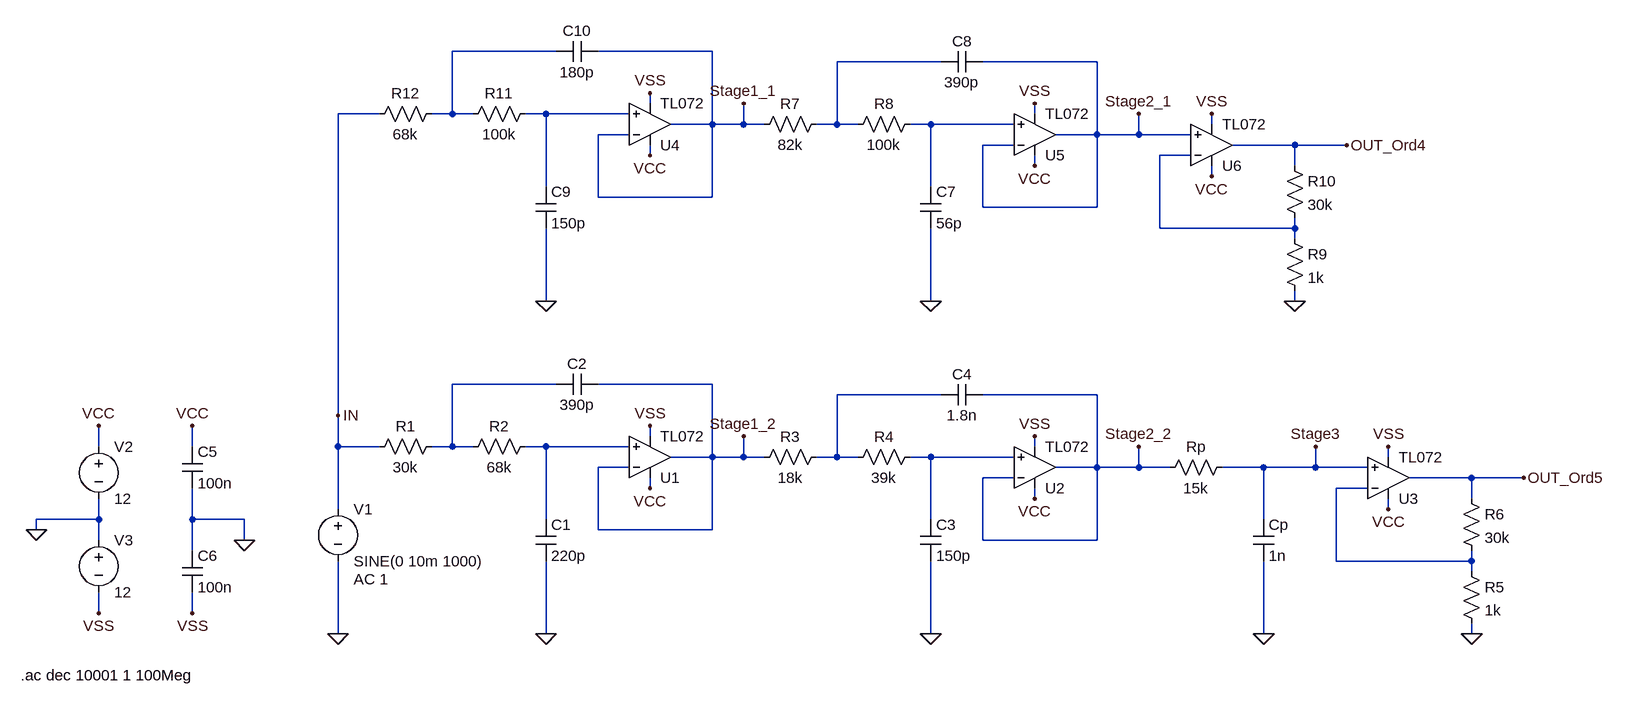
[diagram p0: schematic SK_ordnung4vgl5_10kHz_1dB_30dB_butter_3OPV.asc]
SK_ordnung4vgl5_10kHz_1dB_30dB_butter_3OPV.asc, the LTspice schematic file:
Version 4
SHEET 1 1468 736
WIRE -160 -416 -320 -416
WIRE 80 -416 -96 -416
WIRE 432 -400 272 -400
WIRE 672 -400 496 -400
WIRE -16 -336 -16 -352
WIRE -432 -320 -496 -320
WIRE -320 -320 -320 -416
WIRE -320 -320 -352 -320
WIRE -288 -320 -320 -320
WIRE -176 -320 -208 -320
WIRE -48 -320 -176 -320
WIRE 576 -320 576 -336
WIRE 80 -304 80 -416
WIRE 80 -304 16 -304
WIRE 128 -304 128 -336
WIRE 128 -304 80 -304
WIRE 160 -304 128 -304
WIRE 272 -304 272 -400
WIRE 272 -304 240 -304
WIRE 304 -304 272 -304
WIRE 416 -304 384 -304
WIRE 544 -304 416 -304
WIRE 848 -304 848 -320
WIRE -48 -288 -96 -288
WIRE 672 -288 672 -400
WIRE 672 -288 608 -288
WIRE 736 -288 736 -320
WIRE 736 -288 672 -288
WIRE 816 -288 736 -288
WIRE 544 -272 496 -272
WIRE 976 -272 880 -272
WIRE 1056 -272 976 -272
WIRE -16 -256 -16 -272
WIRE 816 -256 768 -256
WIRE 576 -240 576 -256
WIRE 976 -240 976 -272
WIRE 848 -224 848 -240
WIRE -176 -208 -176 -320
WIRE 416 -208 416 -304
WIRE -96 -192 -96 -288
WIRE 80 -192 80 -304
WIRE 80 -192 -96 -192
WIRE 496 -176 496 -272
WIRE 672 -176 672 -288
WIRE 672 -176 496 -176
WIRE 768 -144 768 -256
WIRE 976 -144 976 -160
WIRE 976 -144 768 -144
WIRE 976 -128 976 -144
WIRE -176 -32 -176 -144
WIRE 416 -32 416 -144
WIRE 976 -32 976 -48
WIRE -160 96 -320 96
WIRE 80 96 -96 96
WIRE 432 112 272 112
WIRE 672 112 496 112
WIRE -496 144 -496 -320
WIRE -16 176 -16 160
WIRE -864 192 -864 160
WIRE -720 192 -720 160
WIRE -496 192 -496 144
WIRE -432 192 -496 192
WIRE -320 192 -320 96
WIRE -320 192 -352 192
WIRE -288 192 -320 192
WIRE -176 192 -208 192
WIRE -48 192 -176 192
WIRE 576 192 576 176
WIRE 80 208 80 96
WIRE 80 208 16 208
WIRE 128 208 128 176
WIRE 128 208 80 208
WIRE 160 208 128 208
WIRE 272 208 272 112
WIRE 272 208 240 208
WIRE 304 208 272 208
WIRE 416 208 384 208
WIRE 544 208 416 208
WIRE 1120 208 1120 192
WIRE -48 224 -96 224
WIRE 672 224 672 112
WIRE 672 224 608 224
WIRE 736 224 736 192
WIRE 736 224 672 224
WIRE 784 224 736 224
WIRE 928 224 864 224
WIRE 1008 224 1008 192
WIRE 1008 224 928 224
WIRE 1088 224 1008 224
WIRE 544 240 496 240
WIRE 1248 240 1152 240
WIRE 1328 240 1248 240
WIRE -16 256 -16 240
WIRE 1088 256 1040 256
WIRE 576 272 576 256
WIRE 1248 272 1248 240
WIRE -496 288 -496 192
WIRE 1120 288 1120 272
WIRE -864 304 -864 272
WIRE -864 304 -960 304
WIRE -720 304 -720 256
WIRE -640 304 -720 304
WIRE -176 304 -176 192
WIRE 416 304 416 208
WIRE 928 304 928 224
WIRE -960 320 -960 304
WIRE -96 320 -96 224
WIRE 80 320 80 208
WIRE 80 320 -96 320
WIRE -864 336 -864 304
WIRE -640 336 -640 304
WIRE 496 336 496 240
WIRE 672 336 672 224
WIRE 672 336 496 336
WIRE -720 352 -720 304
WIRE 1040 368 1040 256
WIRE 1248 368 1248 352
WIRE 1248 368 1040 368
WIRE 1248 384 1248 368
WIRE -864 448 -864 416
WIRE -720 448 -720 416
WIRE -496 480 -496 368
WIRE -176 480 -176 368
WIRE 416 480 416 368
WIRE 928 480 928 368
WIRE 1248 480 1248 464
FLAG 1248 480 0
FLAG 416 480 0
FLAG -176 480 0
FLAG -864 160 VCC
FLAG -864 448 VSS
FLAG -16 160 VSS
FLAG 576 176 VSS
FLAG 1120 192 VSS
FLAG -16 256 VCC
FLAG 576 272 VCC
FLAG 1120 288 VCC
FLAG -960 320 0
FLAG -720 160 VCC
FLAG -720 448 VSS
FLAG -640 336 0
FLAG -496 480 0
FLAG 1328 240 OUT_Ord5
FLAG 736 192 Stage2_2
FLAG 128 176 Stage1_2
FLAG -496 144 IN
FLAG 928 480 0
FLAG 1008 192 Stage3
FLAG 976 -32 0
FLAG 416 -32 0
FLAG -176 -32 0
FLAG -16 -352 VSS
FLAG 576 -336 VSS
FLAG 848 -320 VSS
FLAG -16 -256 VCC
FLAG 576 -240 VCC
FLAG 848 -224 VCC
FLAG 1056 -272 OUT_Ord4
FLAG 736 -320 Stage2_1
FLAG 128 -336 Stage1_1
SYMBOL res 256 192 R90
WINDOW 0 0 56 VBottom 2
WINDOW 3 32 56 VTop 2
SYMATTR InstName R3
SYMATTR Value 18k
SYMBOL res 400 192 R90
WINDOW 0 0 56 VBottom 2
WINDOW 3 32 56 VTop 2
SYMATTR InstName R4
SYMATTR Value 39k
SYMBOL res 1232 368 R0
SYMATTR InstName R5
SYMATTR Value 1k
SYMBOL res 1232 256 R0
SYMATTR InstName R6
SYMATTR Value 30k
SYMBOL cap 400 304 R0
SYMATTR InstName C3
SYMATTR Value 150p
SYMBOL cap 496 96 R90
WINDOW 0 0 32 VBottom 2
WINDOW 3 32 32 VTop 2
SYMATTR InstName C4
SYMATTR Value 1.8n
SYMBOL res -336 176 R90
WINDOW 0 0 56 VBottom 2
WINDOW 3 32 56 VTop 2
SYMATTR InstName R1
SYMATTR Value 30k
SYMBOL res -192 176 R90
WINDOW 0 0 56 VBottom 2
WINDOW 3 32 56 VTop 2
SYMATTR InstName R2
SYMATTR Value 68k
SYMBOL cap -192 304 R0
SYMATTR InstName C1
SYMATTR Value 220p
SYMBOL cap -96 80 R90
WINDOW 0 0 32 VBottom 2
WINDOW 3 32 32 VTop 2
SYMATTR InstName C2
SYMATTR Value 390p
SYMBOL voltage -496 272 R0
WINDOW 123 24 124 Left 2
WINDOW 39 0 0 Left 0
SYMATTR Value2 AC 1
SYMATTR InstName V1
SYMATTR Value SINE(0 10m 1000)
SYMBOL voltage -864 176 R0
WINDOW 123 0 0 Left 0
WINDOW 39 0 0 Left 0
SYMATTR InstName V2
SYMATTR Value 12
SYMBOL voltage -864 320 R0
WINDOW 123 0 0 Left 0
WINDOW 39 0 0 Left 0
SYMATTR InstName V3
SYMATTR Value 12
SYMBOL cap -736 192 R0
SYMATTR InstName C5
SYMATTR Value 100n
SYMBOL cap -736 352 R0
SYMATTR InstName C6
SYMATTR Value 100n
SYMBOL TL072 -16 272 M180
SYMATTR InstName U1
SYMBOL TL072 576 288 M180
SYMATTR InstName U2
SYMBOL TL072 1120 304 M180
SYMATTR InstName U3
SYMBOL res 880 208 R90
WINDOW 0 0 56 VBottom 2
WINDOW 3 32 56 VTop 2
SYMATTR InstName Rp
SYMATTR Value 15k
SYMBOL cap 912 304 R0
SYMATTR InstName Cp
SYMATTR Value 1n
SYMBOL res 256 -320 R90
WINDOW 0 0 56 VBottom 2
WINDOW 3 32 56 VTop 2
SYMATTR InstName R7
SYMATTR Value 82k
SYMBOL res 400 -320 R90
WINDOW 0 0 56 VBottom 2
WINDOW 3 32 56 VTop 2
SYMATTR InstName R8
SYMATTR Value 100k
SYMBOL res 960 -144 R0
SYMATTR InstName R9
SYMATTR Value 1k
SYMBOL res 960 -256 R0
SYMATTR InstName R10
SYMATTR Value 30k
SYMBOL cap 400 -208 R0
SYMATTR InstName C7
SYMATTR Value 56p
SYMBOL cap 496 -416 R90
WINDOW 0 0 32 VBottom 2
WINDOW 3 32 32 VTop 2
SYMATTR InstName C8
SYMATTR Value 390p
SYMBOL res -192 -336 R90
WINDOW 0 0 56 VBottom 2
WINDOW 3 32 56 VTop 2
SYMATTR InstName R11
SYMATTR Value 100k
SYMBOL cap -192 -208 R0
SYMATTR InstName C9
SYMATTR Value 150p
SYMBOL cap -96 -432 R90
WINDOW 0 0 32 VBottom 2
WINDOW 3 32 32 VTop 2
SYMATTR InstName C10
SYMATTR Value 180p
SYMBOL TL072 -16 -240 M180
SYMATTR InstName U4
SYMBOL TL072 576 -224 M180
SYMATTR InstName U5
SYMBOL TL072 848 -208 M180
SYMATTR InstName U6
SYMBOL res -336 -336 R90
WINDOW 0 0 56 VBottom 2
WINDOW 3 32 56 VTop 2
SYMATTR InstName R12
SYMATTR Value 68k
TEXT -984 544 Left 2 !.ac dec 10001 1 100Meg

The netlist it stands for:
* SK_ordnung4vgl5_10kHz_1dB_30dB_butter_3OPV.asc
R3 N007 Stage1_2 18k
R4 N009 N007 39k
R5 N010 0 1k
R6 OUT_Ord5 N010 30k
C3 N009 0 150p
C4 Stage2_2 N007 1.8n
R1 N006 IN 30k
R2 N008 N006 68k
C1 N008 0 220p
C2 Stage1_2 N006 390p
V1 IN 0 SINE(0 10m 1000) AC 1
V2 VCC 0 12
V3 0 VSS 12
C5 VCC 0 100n
C6 0 VSS 100n
* U1: TL072 (symbol TL072 not available, pins judged from their places): In+=N008 In-=Stage1_2 V+=VCC V-=VSS OUT=Stage1_2
* U2: TL072 (symbol TL072 not available, pins judged from their places): In+=N009 In-=Stage2_2 V+=VCC V-=VSS OUT=Stage2_2
* U3: TL072 (symbol TL072 not available, pins judged from their places): In+=Stage3 In-=N010 V+=VCC V-=VSS OUT=OUT_Ord5
Rp Stage3 Stage2_2 15k
Cp Stage3 0 1n
R7 N002 Stage1_1 82k
R8 N004 N002 100k
R9 N005 0 1k
R10 OUT_Ord4 N005 30k
C7 N004 0 56p
C8 Stage2_1 N002 390p
R11 N003 N001 100k
C9 N003 0 150p
C10 Stage1_1 N001 180p
* U4: TL072 (symbol TL072 not available, pins judged from their places): In+=N003 In-=Stage1_1 V+=VCC V-=VSS OUT=Stage1_1
* U5: TL072 (symbol TL072 not available, pins judged from their places): In+=N004 In-=Stage2_1 V+=VCC V-=VSS OUT=Stage2_1
* U6: TL072 (symbol TL072 not available, pins judged from their places): In+=Stage2_1 In-=N005 V+=VCC V-=VSS OUT=OUT_Ord4
R12 N001 IN 68k
.ac dec 10001 1 100Meg
.backanno
.end